# EAGLE schematic esp8266_GSM (EAGLE 9.6.2)

## Sheet 1 of 2
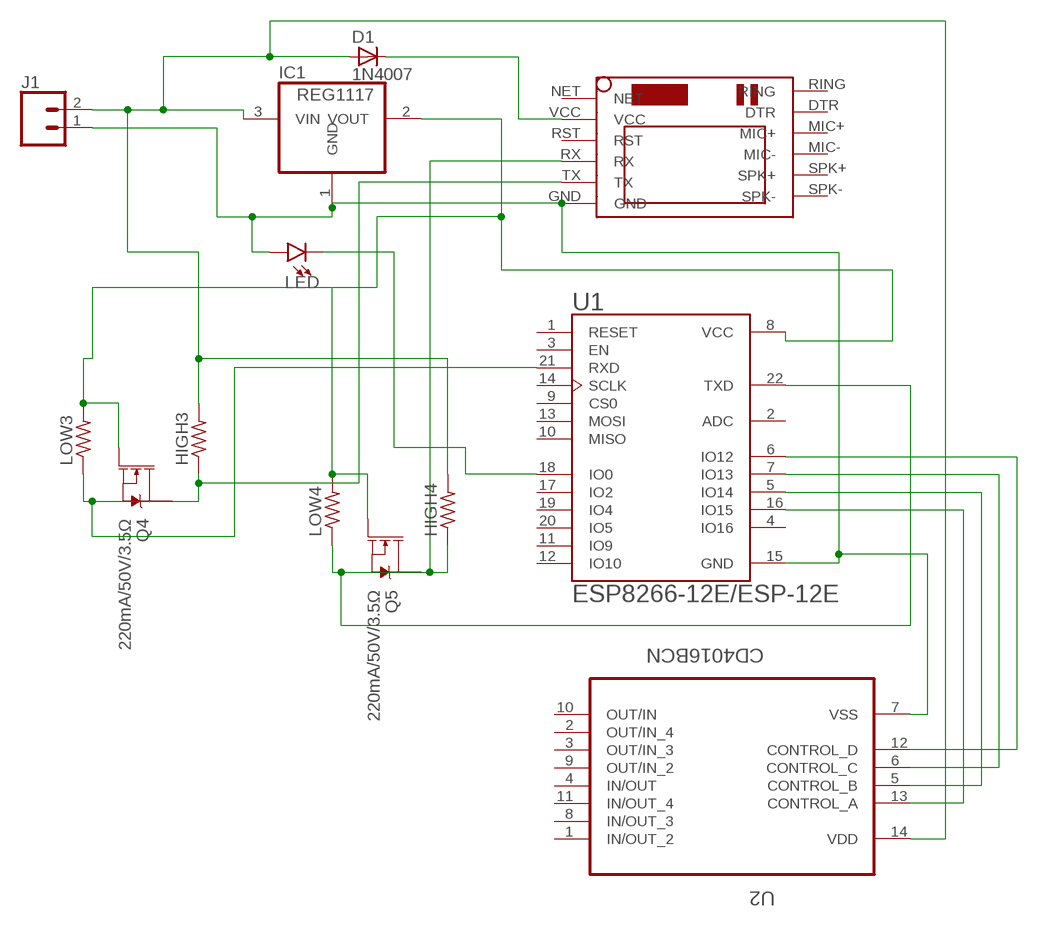
[diagram p0: schematic, sheet 1]

### Parts
D1  1N4007  [SMA]
HIGH3  R-US_R1206  [R1206]
HIGH4  R-US_R1206  [R1206]
IC1  REG1117  [SOT223]
J1  CONN_025MM  [SCREWTERMINAL-5MM-2]
LED  LED1206  [LED-1206]
LOW3  R-US_R1206  [R1206]
LOW4  R-US_R1206  [R1206]
Q4  220mA/50V/3.5Ω  MOSFET-NCH-BSS138  [SOT23-3]
Q5  220mA/50V/3.5Ω  MOSFET-NCH-BSS138  [SOT23-3]
U1  ESP8266-12E/ESP-12E  [XCVR_ESP8266-12E/ESP-12E]
U2  CD4016BCN  [DIP254P762X508-14]
U$1  SIM800LMODULE  [SIM800LMODULE]

### Nets
N$3: LED.C U1.18(IO0)
N$5: D1.K(C) U$1.VCC
N$6: IC1.1(GND) J1.1 LED.A U1.15(GND) U2.7(VSS) U$1.GND
N$7: U1.6(IO12) U2.12(CONTROL_D)
N$8: U1.7(IO13) U2.6(CONTROL_C)
N$10: LOW3.1 Q4.3(D) U1.21(RXD)
N$11: HIGH3.1 Q4.2(S) U$1.TX
N$12: U1.5(IO14) U2.5(CONTROL_B)
N$13: LOW4.1 Q5.3(D) U1.22(TXD)
N$14: HIGH4.1 Q5.2(S) U$1.RX
N$15: IC1.2(VOUT) LOW3.2 LOW4.2 Q4.1(G) Q5.1(G) U1.8(VCC)
N$16: U1.16(IO15) U2.13(CONTROL_A)
N$17: D1.A HIGH3.2 HIGH4.2 IC1.3(VIN) J1.2 U2.14(VDD)
Unconnected: U1.1(RESET) U1.2(ADC) U1.3(EN) U1.4(IO16) U1.9(CS0) U1.10(MISO) U1.11(IO9) U1.12(IO10) U1.13(MOSI) U1.14(SCLK) U1.17(IO2) U1.19(IO4) U1.20(IO5) U2.1(IN/OUT_2) U2.2(OUT/IN_4) U2.3(OUT/IN_3) U2.4(IN/OUT) U2.8(IN/OUT_3) U2.9(OUT/IN_2) U2.10(OUT/IN) U2.11(IN/OUT_4) U$1.DTR U$1.MIC+ U$1.MIC- U$1.NET U$1.RING U$1.RST U$1.SPK+ U$1.SPK-

## Sheet 2 of 2
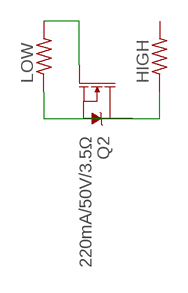
[diagram p1: schematic, sheet 2]

### Parts
HIGH  R-US_R1206  [R1206]
LOW  R-US_R1206  [R1206]
Q2  220mA/50V/3.5Ω  MOSFET-NCH-BSS138  [SOT23-3]

### Nets
N$1: LOW.1 Q2.3(D)
N$2: HIGH.1 Q2.2(S)
N$9: LOW.2 Q2.1(G)
Unconnected: HIGH.2

## Library data of the parts
D1 = casovac:1N4007
HIGH HIGH3 HIGH4 LOW LOW3 LOW4 = adafruit:R-US_: RESISTOR, American symbol
IC1 = burr-brown:REG1117: 800mA and 1A Low Dropout (LDO) Positive Regulator 1.8V, 2.5V, 2.85V, 3.3V, 5V, and Adj; MPN: REG1117; OC_FARNELL: 1097566; OC_NEWARK: 14P6981
J1 = SparkFun-Retired:CONN_02: Multi connection point. Often used as Generic Header-pin footprint for 0.1 inch spaced/style header connections On any of the 0.1 inch spaced packages, you can populate with these: Break Away Headers - Straight <https://www.sparkfun.com/products/116> (PRT-00116) Break Away Male Headers - Right Angle <https://www.sparkfun.com/products/553> (PRT-00553) Female Headers <https://www.sparkfun.com/products/115> (PRT-00115) Break Away Headers - Machine Pin <https://www.sparkfun.com/products/117> (PRT-00117) Break Away Female Headers - Swiss Machine Pin <https://www.sparkfun.com/products/743> (PRT-00743) For SCREWTERMINALS and SPRING TERMINALS visit here: Screw Terimnals on SparkFun.com <https://www.sparkfun.com/search/results?term=Screw+Terminals> (5mm/3.5mm/2.54mm spacing) This device is also useful as a general connection point to wire up your design to another part of your project. Our various solder wires solder well into these plated through hole pads. Hook-Up Wire - Assortment (Stranded, 22 AWG) <https://www.sparkfun.com/products/11375> (PRT-11375) Hook-Up Wire - Assortment (Solid Core, 22 AWG) <https://www.sparkfun.com/products/11367> (PRT-11367) View the entire wire category on our website here <https://www.sparkfun.com/categories/141> Special notes: Molex polarized connector foot print use with: PRT-08233 with associated crimp pins and housings. 2.54_SCREWTERM for use with PRT-10571. 3.5mm Screw Terminal footprints for PRT-08084 5mm Screw Terminal footprints for use with PRT-08432; SF_SKU: PRT-08432
LED = SparkFun-LED:LED: LED (Generic) Standard schematic elements and footprints for 5mm, 3mm, 1206, and 0603 sized LEDs. Generic LEDs with no color specified.
Q2 Q4 Q5 = SparkFun-DiscreteSemi:MOSFET-NCH: N-channel MOSFETs Voltage controlled devices that allow control of high current outputs. SparkFun Products: SparkFun OpenScale <https://www.sparkfun.com/products/13261> SparkFun Digital Sandbox <https://www.sparkfun.com/products/12651> SparkFun Monster Moto Shield <https://www.sparkfun.com/products/10182> SparkFun MOSFET Power Controller <https://www.sparkfun.com/products/11214>; PROD_ID: TRANS-00830
U1 = ESP8266-12E_ESP-12E:ESP8266-12E/ESP-12E: ESP-12E WiFi Module; AVAILABILITY: Unavailable; DESCRIPTION: This WiFi module has a 32-bit MCU micro and clock speeds supporting 80 MHz or 160 MHz. Supports the RTOS and integrated Wi-Fi MAC/BB/RF/PA/LNA, and has an on-board antenna.; MF: AI-Thinker; MP: ESP8266-12E/ESP-12E; PACKAGE: None; PRICE: None
U2 = CD4016BCN:CD4016BCN: Quad Bilateral Switch Check prices <https://pricing.snapeda.com/parts/CD4016BCN/ON%20Semiconductor/view-part?ref=eda>; AVAILABILITY: Warning; DESCRIPTION: Bilateral, FET Switches 1 x 1:1 14-PDIP; MF: ON Semiconductor; MP: CD4016BCN; PACKAGE: PDIP-14 ON Semiconductor; PRICE: None; PURCHASE-URL: https://pricing.snapeda.com/search/part/CD4016BCN/?ref=eda
U$1 = SIM800LMODULE:SIM800LMODULE: SIM800L Module